# Altium schematic sheet OZ440-SE140-CAR001_sheet6_Sensor_Connector.SchDoc
size A3
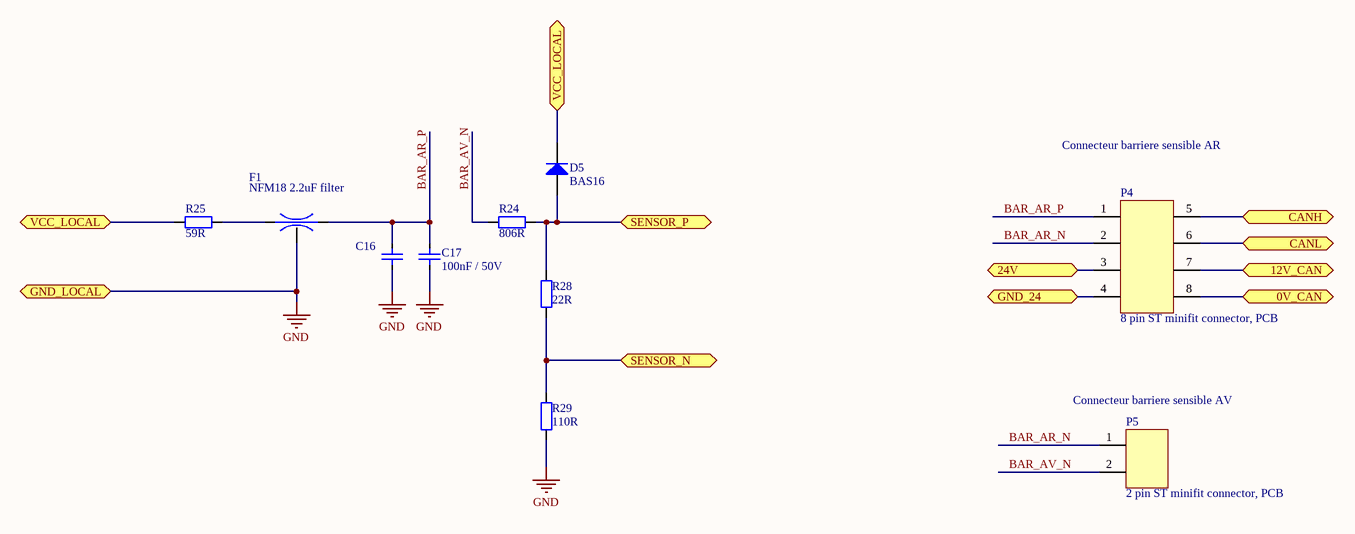
[diagram p0: OZ440-SE140-CAR001_sheet6_Sensor_Connector.SchDoc]

## Parts
C16  CAP-SMD  [C0805-STD]  (value not drawn)
C17  Displayed reference: 100nF / 50V  [C0805-STD]  (hidden comment: CAP-SMD)
D5  Displayed reference: BAS16  [SOT23-STD]  (hidden comment: BAS16-SOT23)
F1  Displayed reference: NFM18 2.2uF filter  [LC_0603-STD]  (hidden comment: LC_FILTER-STD)
P4  Displayed reference: 8 pin ST minifit connector, PCB  [CONN-SPE_MOLEX_39-28-1083]  (hidden comment: CONN-SPE-8P_MOLEX_39-28-1083)
P5  Displayed reference: 2 pin ST minifit connector, PCB  [CONN-SPE_MOLEX_39-28-1023]  (hidden comment: CONN-SPE-8P_MOLEX_39-28-1023)
R24  Displayed reference: 806R  [R0805-STD]  (hidden comment: RES-SMD)
R25  Displayed reference: 59R  [R0805-STD]  (hidden comment: RES-SMD)
R28  Displayed reference: 22R  [R0805-STD]  (hidden comment: RES-SMD)
R29  Displayed reference: 110R  [R0805-STD]  (hidden comment: RES-SMD)

## Ports
0V_CAN, 12V_CAN, 24V, CANH, CANL, GND_24, GND_LOCAL, SENSOR_N, SENSOR_P, VCC_LOCAL

## Nets
GND: C16.1 C17.2 F1.3(G) R29.1 ; port GND_LOCAL
0V_CAN: P4.8 ; port 0V_CAN
12V_CAN: P4.7 ; port 12V_CAN
24V: P4.3 ; port 24V
BAR_AR_N: P4.2 P5.1
BAR_AR_P: C16.2 C17.1 F1.2(B) P4.1
BAR_AV_N: P5.2 R24.2
CANH: P4.5 ; port CANH
CANL: P4.6 ; port CANL
GND_24: P4.4 ; port GND_24
SENSOR_N: R28.1 R29.2 ; port SENSOR_N
SENSOR_P: D5.1(A) R24.1 R28.2 ; port SENSOR_P
VCC_LOCAL: D5.3(K) R25.1 ; port VCC_LOCAL
NetF1_1: F1.1(A) R25.2

## Notes on the sheet
- Connecteur barriere sensible AR
- (near P5) Connecteur barriere sensible AV
- Titre document:
- NAIO TECHNOLOGIES
- 3 Av didier Daurat
- 31400 TOULOUSE
- Auteur:
- Numéro document:
- Verificateur:
- Format:
- A3
- Date:
- Revision:
- Page:
- /

## Library data of the parts
C16 C17 = VJ0805Y104KXAxx: 0805 100nF / 50V  X7R ceramic capacitor; Manufacturer: vishay; Max Voltage: 50; Tolerance: +/- 10%; Validated: N; Reference: VJ0805Y104KXAxx; Value: 100nF; Material: X7R; Footprint description: standard Capacitor 0805; Pin Count: 2; helpURL: http://www.vishay.com/docs/45200/highrels.pdf; Supplier 1: Farnell; Supplier Part Number 1: 1612208; Supplier 2: Digi-Key; Supplier Part Number 2: 720-1266-6-ND
  C16: Displayed reference: 100nF / 50V
D5 = BAS16: 100V / 120mA signal  diode; Manufacturer: NXP; Max Voltage: 100; Max Current: 0.2A; Validated: False; Reference: BAS16; component type: DIODE; Footprint description: Sot23 SMD package; Pin Count: 3; Rev: 2010; helpURL: http://www.nxp.com/documents/data_sheet/BAS16_SER.pdf; Supplier 1: Farnell; Supplier Part Number 1: 1081180; Supplier 2: Digi-Key; Supplier Part Number 2: 568-1596-1-ND
F1 = NFM18PC225B0J3: 2A LC filter; Manufacturer: MURATA; Max Voltage: 6.3; Frequency band: 0-20Mhz; Validated: False; Reference: NFM18PC225B0J3; Max Current: 2A; Footprint description: standard 0603 filter package; Pin Count: 3; Rev: 2/11/2011; helpURL: http://www.murata.com/products/emc/application/pdf/EMIAPDCE_2.pdf; Supplier 1: Digi-Key; Supplier Part Number 1: NFM18PC225B0J3D-ND; Supplier 2: Mouser; Supplier Part Number 2: 81-NFM18PC225B0J3D
P4 = 39-28-1083: 8 pin Minifit connector; Manufacturer: Molex; Max Voltage: 600V; Max Current: 9A; Validated: False; Reference: 39-28-1083; Footprint description: 8 pin connector ST, TH; Pin Count: 8; Rev: L7; helpURL: http://www.molex.com/pdm_docs/sd/039281083_sd.pdf; Supplier 1: Mouser; Supplier Part Number 1: 538-39-28-1083; Supplier 2: Farnell; Supplier Part Number 2: 9732110
P5 = 39-28-1023: 2 pin Minifit connector; Manufacturer: Molex; Max Voltage: 600V; Max Current: 9A; Validated: False; Reference: 39-28-1023; Footprint description: 2 pin connector ST, TH; Pin Count: 2; Rev: L7; helpURL: http://www.molex.com/pdm_docs/sd/039281083_sd.pdf; Supplier 1: Mouser; Supplier Part Number 1: 538-39-28-1023; Supplier 2: Farnell; Supplier Part Number 2: 9732080
R24 = CRCW0805866KFKxx: 866k Ohm 0805 SMD resistor; Manufacturer: Vishay; Reference: CRCW0805806RFKxx; Value: 806; Tolerance: 1%; Rated Power: 0.125W; Validated: False; Footprint description: standard 0805 SMD; Pin Count: 2; helpURL: http://www.vishay.com/docs/20035/dcrcwe3.pdf
R25 = CRCW080559R0FKxx: 59 Ohm 0805 SMD resistor; Manufacturer: Vishay; Value: 59; Tolerance: 1 %; Rated Power: 0.125 W; Validated: No; Reference: CRCW080559R0FKxx; Footprint description: standard 0805 SMD; Pin Count: 2; helpURL: http://www.vishay.com/docs/20035/dcrcwe3.pdf; Supplier 1: Mouser; Supplier Part Number 1: 71-CRCW080559R0FKEA; Supplier 2: Farnell; Supplier Part Number 2: 2138817
R28 = CRCW080522R0FKxx: 22 Ohm 0805 SMD resistor; Manufacturer: Vishay; Value: 22; Tolerance: 1 %; Rated Power: 0.125 W; Validated: No; Reference: CRCW080522R0FKxx; Footprint description: standard 0805 SMD; Pin Count: 2; helpURL: http://www.vishay.com/docs/20035/dcrcwe3.pdf; Supplier 1: Farnell; Supplier Part Number 1: 1652962; Supplier 2: Mouser; Supplier Part Number 2: 71-CRCW0805-22-E3
R29 = CRCW080522R0FKxx: 22 Ohm 0805 SMD resistor; Manufacturer: Vishay; Reference: CRCW0805110RFKxx; Value: 110; Tolerance: 1 %; Rated Power: 0.125 W; Validated: No; Footprint description: standard 0805 SMD; Pin Count: 2; helpURL: http://www.vishay.com/docs/20035/dcrcwe3.pdf